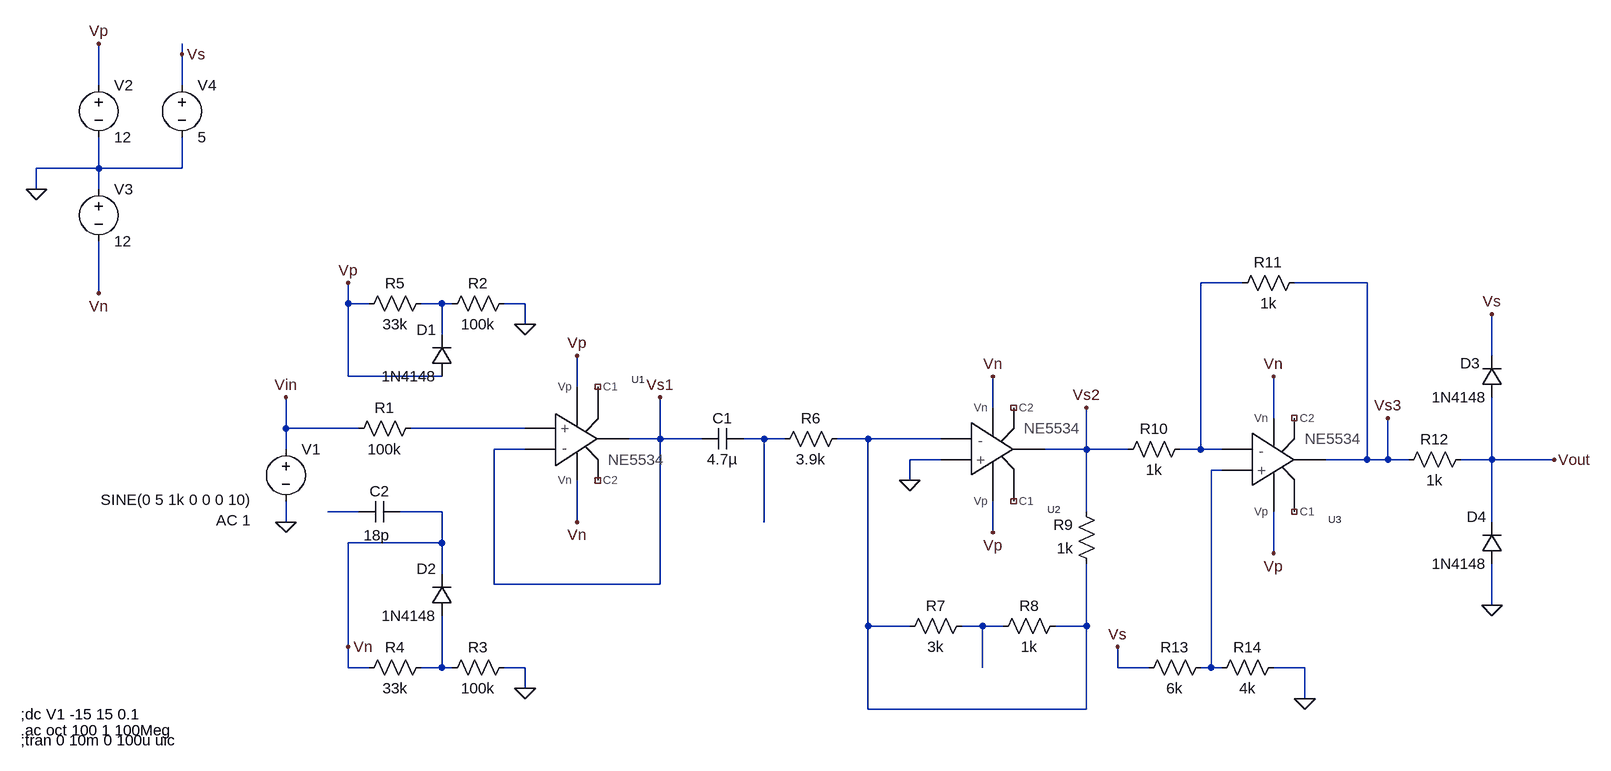
[diagram p0: schematic Analog Portion NE5534.asc]
Analog Portion NE5534.asc, the LTspice schematic file:
Version 4
SHEET 1 1768 680
WIRE -448 -464 -448 -480
WIRE -576 -416 -576 -480
WIRE -448 -416 -448 -464
WIRE -576 -288 -576 -336
WIRE -576 -288 -672 -288
WIRE -448 -288 -448 -336
WIRE -448 -288 -576 -288
WIRE -672 -256 -672 -288
WIRE -576 -256 -576 -288
WIRE 1184 -112 1120 -112
WIRE 1376 -112 1264 -112
WIRE -576 -96 -576 -176
WIRE -192 -80 -192 -112
WIRE -160 -80 -192 -80
WIRE -48 -80 -80 -80
WIRE -32 -80 -48 -80
WIRE 80 -80 48 -80
WIRE 80 -48 80 -80
WIRE -48 -32 -48 -80
WIRE 1568 0 1568 -64
WIRE -192 32 -192 -80
WIRE -48 32 -192 32
WIRE 160 48 160 0
WIRE 800 80 800 32
WIRE 1232 96 1232 32
WIRE -288 112 -288 64
WIRE -176 112 -288 112
WIRE 80 112 -96 112
WIRE 288 128 288 64
WIRE 288 128 240 128
WIRE 352 128 288 128
WIRE 448 128 416 128
WIRE 480 128 448 128
WIRE 608 128 560 128
WIRE 720 128 608 128
WIRE -288 144 -288 112
WIRE 80 144 32 144
WIRE 944 144 944 80
WIRE 944 144 880 144
WIRE 1008 144 944 144
WIRE 1120 144 1120 -112
WIRE 1120 144 1088 144
WIRE 1152 144 1120 144
WIRE 720 160 672 160
WIRE 1376 160 1376 -112
WIRE 1376 160 1312 160
WIRE 1408 160 1408 96
WIRE 1408 160 1376 160
WIRE 1440 160 1408 160
WIRE 1568 160 1568 64
WIRE 1568 160 1520 160
WIRE 1664 160 1568 160
WIRE 1152 176 1136 176
WIRE 672 192 672 160
WIRE -176 240 -224 240
WIRE -48 240 -112 240
WIRE 944 240 944 144
WIRE -288 256 -288 224
WIRE 160 256 160 192
WIRE 448 256 448 128
WIRE 1568 256 1568 160
WIRE 800 272 800 224
WIRE -48 288 -48 240
WIRE -48 288 -192 288
WIRE 1232 304 1232 240
WIRE -48 336 -48 288
WIRE 32 352 32 144
WIRE 288 352 288 128
WIRE 288 352 32 352
WIRE 1568 384 1568 320
WIRE 608 416 608 128
WIRE 672 416 608 416
WIRE 784 416 752 416
WIRE 816 416 784 416
WIRE 944 416 944 320
WIRE 944 416 896 416
WIRE -192 448 -192 288
WIRE -192 480 -192 448
WIRE -160 480 -192 480
WIRE -48 480 -48 400
WIRE -48 480 -80 480
WIRE -32 480 -48 480
WIRE 80 480 48 480
WIRE 784 480 784 416
WIRE 992 480 992 448
WIRE 1040 480 992 480
WIRE 1136 480 1136 176
WIRE 1136 480 1120 480
WIRE 1152 480 1136 480
WIRE 1280 480 1232 480
WIRE 80 512 80 480
WIRE 1280 528 1280 480
WIRE 608 544 608 416
WIRE 944 544 944 416
WIRE 944 544 608 544
FLAG 80 -48 0
FLAG 80 512 0
FLAG -288 256 0
FLAG -672 -256 0
FLAG -576 -480 Vp
FLAG -576 -96 Vn
FLAG 160 0 Vp
FLAG 160 256 Vn
FLAG -192 -112 Vp
FLAG -192 448 Vn
FLAG 800 32 Vn
FLAG 800 272 Vp
FLAG 672 192 0
FLAG 1232 32 Vn
FLAG 1232 304 Vp
FLAG -288 64 Vin
FLAG 288 64 Vs1
FLAG 944 80 Vs2
FLAG 1408 96 Vs3
FLAG 1664 160 Vout
FLAG 1568 384 0
FLAG -448 -464 Vs
FLAG 1568 -64 Vs
FLAG 1280 528 0
FLAG 992 448 Vs
SYMBOL res -80 96 R90
WINDOW 0 0 56 VBottom 2
WINDOW 3 32 56 VTop 2
SYMATTR InstName R1
SYMATTR Value 100k
SYMBOL diode -32 32 R180
WINDOW 0 24 72 Left 2
WINDOW 3 24 0 Left 2
SYMATTR InstName D1
SYMATTR Value 1N4148
SYMBOL diode -32 400 R180
WINDOW 0 24 72 Left 2
WINDOW 3 24 0 Left 2
SYMATTR InstName D2
SYMATTR Value 1N4148
SYMBOL res 64 -96 R90
WINDOW 0 0 56 VBottom 2
WINDOW 3 32 56 VTop 2
SYMATTR InstName R2
SYMATTR Value 100k
SYMBOL res 64 464 R90
WINDOW 0 0 56 VBottom 2
WINDOW 3 32 56 VTop 2
SYMATTR InstName R3
SYMATTR Value 100k
SYMBOL res -64 464 R90
WINDOW 0 0 56 VBottom 2
WINDOW 3 32 56 VTop 2
SYMATTR InstName R4
SYMATTR Value 33k
SYMBOL res -64 -96 R90
WINDOW 0 0 56 VBottom 2
WINDOW 3 32 56 VTop 2
SYMATTR InstName R5
SYMATTR Value 33k
SYMBOL voltage -288 128 R0
WINDOW 3 -285 94 Left 2
WINDOW 123 -107 125 Left 2
WINDOW 39 0 0 Left 2
SYMATTR Value SINE(0 5 1k 0 0 0 10)
SYMATTR Value2 AC 1
SYMATTR InstName V1
SYMBOL voltage -576 -432 R0
WINDOW 123 0 0 Left 2
WINDOW 39 0 0 Left 2
SYMATTR InstName V2
SYMATTR Value 12
SYMBOL voltage -576 -272 R0
WINDOW 123 0 0 Left 2
WINDOW 39 0 0 Left 2
SYMATTR InstName V3
SYMATTR Value 12
SYMBOL cap 416 112 R90
WINDOW 0 0 32 VBottom 2
WINDOW 3 32 32 VTop 2
SYMATTR InstName C1
SYMATTR Value 4.7µ
SYMBOL res 576 112 R90
WINDOW 0 0 56 VBottom 2
WINDOW 3 32 56 VTop 2
SYMATTR InstName R6
SYMATTR Value 3.9k
SYMBOL res 768 400 R90
WINDOW 0 0 56 VBottom 2
WINDOW 3 32 56 VTop 2
SYMATTR InstName R7
SYMATTR Value 3k
SYMBOL res 912 400 R90
WINDOW 0 0 56 VBottom 2
WINDOW 3 32 56 VTop 2
SYMATTR InstName R8
SYMATTR Value 1k
SYMBOL res 960 336 R180
WINDOW 0 36 76 Left 2
WINDOW 3 36 40 Left 2
SYMATTR InstName R9
SYMATTR Value 1k
SYMBOL res 1104 128 R90
WINDOW 0 0 56 VBottom 2
WINDOW 3 32 56 VTop 2
SYMATTR InstName R10
SYMATTR Value 1k
SYMBOL res 1280 -128 R90
WINDOW 0 0 56 VBottom 2
WINDOW 3 32 56 VTop 2
SYMATTR InstName R11
SYMATTR Value 1k
SYMBOL res 1536 144 R90
WINDOW 0 0 56 VBottom 2
WINDOW 3 32 56 VTop 2
SYMATTR InstName R12
SYMATTR Value 1k
SYMBOL diode 1584 64 R180
WINDOW 0 34 52 Left 2
WINDOW 3 24 0 Left 2
SYMATTR InstName D3
SYMATTR Value 1N4148
SYMBOL diode 1584 320 R180
WINDOW 0 24 72 Left 2
WINDOW 3 24 0 Left 2
SYMATTR InstName D4
SYMATTR Value 1N4148
SYMBOL voltage -448 -432 R0
WINDOW 123 0 0 Left 2
WINDOW 39 0 0 Left 2
SYMATTR InstName V4
SYMATTR Value 5
SYMBOL res 1136 464 R90
WINDOW 0 0 56 VBottom 2
WINDOW 3 32 56 VTop 2
SYMATTR InstName R13
SYMATTR Value 6k
SYMBOL res 1248 464 R90
WINDOW 0 0 56 VBottom 2
WINDOW 3 32 56 VTop 2
SYMATTR InstName R14
SYMATTR Value 4k
SYMATTR SpiceLine tol=1 pwr=0.1
SYMBOL cap -112 224 R90
WINDOW 0 0 32 VBottom 2
WINDOW 3 37 36 VTop 2
SYMATTR InstName C2
SYMATTR Value 18p
SYMBOL NE5534 128 160 R0
SYMATTR InstName U1
SYMBOL NE5534 768 112 M180
SYMATTR InstName U2
SYMBOL NE5534 1200 128 M180
SYMATTR InstName U3
TEXT -696 552 Left 2 !;dc V1 -15 15 0.1
TEXT -696 576 Left 2 !.ac oct 100 1 100Meg
TEXT -696 592 Left 2 !;tran 0 10m 0 100u uic

The netlist it stands for:
* Analog Portion NE5534.asc
R1 N003 Vin 100k
D1 Vp N002 1N4148
D2 N009 Vn 1N4148
R2 0 N002 100k
R3 0 N009 100k
R4 N009 Vn 33k
R5 N002 Vp 33k
V1 Vin 0 SINE(0 5 1k 0 0 0 10) AC 1
V2 Vp 0 12
V3 0 Vn 12
C1 N004 Vs1 4.7µ
R6 N005 N004 3.9k
R7 N008 N005 3k
R8 N005 N008 1k
R9 N005 Vs2 1k
R10 N001 Vs2 1k
R11 Vs3 N001 1k
R12 Vout Vs3 1k
D3 Vout Vs 1N4148
D4 0 Vout 1N4148
V4 Vs 0 5
R13 N006 Vs 6k
R14 0 N006 4k tol=1 pwr=0.1
C2 Vn N007 18p
XU1 N003 Vs1 Vp Vn Vs1 NC_01 NC_02 NE5534 NE5534  ; pins + - Vp Vn O C1 C2
XU2 0 N005 Vp Vn Vs2 NC_03 NC_04 NE5534 NE5534  ; pins + - Vp Vn O C1 C2
XU3 N006 N001 Vp Vn Vs3 NC_05 NC_06 NE5534 NE5534  ; pins + - Vp Vn O C1 C2
.model D D
.lib standard.dio
;dc V1 -15 15 0.1
.ac oct 100 1 100Meg
;tran 0 10m 0 100u uic
.lib NE5534.cir
.backanno
.end